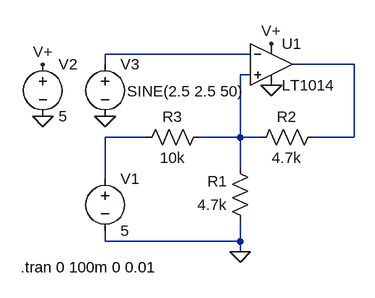
[diagram p0: schematic InvertierenderSchmitttrigger.asc]
InvertierenderSchmitttrigger.asc, the LTspice schematic file:
Version 4
SHEET 1 880 680
WIRE 192 112 -32 112
WIRE -32 128 -32 112
WIRE 352 128 256 128
WIRE 192 144 176 144
WIRE 32 240 -32 240
WIRE 176 240 176 144
WIRE 176 240 112 240
WIRE 208 240 176 240
WIRE 352 240 352 128
WIRE 352 240 288 240
WIRE 176 288 176 240
WIRE -32 304 -32 240
WIRE -32 400 -32 384
WIRE 176 400 176 368
WIRE 176 400 -32 400
WIRE 176 416 176 400
FLAG 176 416 0
FLAG -128 128 V+
FLAG -128 208 0
FLAG 224 96 V+
FLAG 224 160 0
FLAG -32 208 0
SYMBOL Opamps\\LT1014 224 64 R0
SYMATTR InstName U1
SYMBOL voltage -128 112 R0
WINDOW 123 0 0 Left 2
WINDOW 39 0 0 Left 2
SYMATTR InstName V2
SYMATTR Value 5
SYMBOL res 192 384 R180
WINDOW 0 36 76 Left 2
WINDOW 3 36 40 Left 2
SYMATTR InstName R1
SYMATTR Value 4.7k
SYMBOL res 16 256 R270
WINDOW 0 32 56 VTop 2
WINDOW 3 0 56 VBottom 2
SYMATTR InstName R3
SYMATTR Value 10k
SYMBOL voltage -32 288 R0
WINDOW 123 0 0 Left 2
WINDOW 39 0 0 Left 2
SYMATTR InstName V1
SYMATTR Value 5
SYMBOL voltage -32 112 R0
WINDOW 3 34 57 Left 2
WINDOW 123 0 0 Left 2
WINDOW 39 0 0 Left 2
SYMATTR InstName V3
SYMATTR Value SINE(2.5 2.5 50)
SYMBOL res 304 224 R90
WINDOW 0 0 56 VBottom 2
WINDOW 3 32 56 VTop 2
SYMATTR InstName R2
SYMATTR Value 4.7k
TEXT -162 440 Left 2 !.tran 0 100m 0 0.01

The netlist it stands for:
* InvertierenderSchmitttrigger.asc
XU1 N003 N001 V+ 0 N002 LT1014  ; pins In+ In- V+ V- OUT
V2 V+ 0 5
R1 0 N003 4.7k
R3 N004 N003 10k
V1 N004 0 5
V3 N001 0 SINE(2.5 2.5 50)
R2 N002 N003 4.7k
.tran 0 100m 0 0.01
.backanno
.end